# Altium schematic sheet BTN7971b.SchDoc
size A4
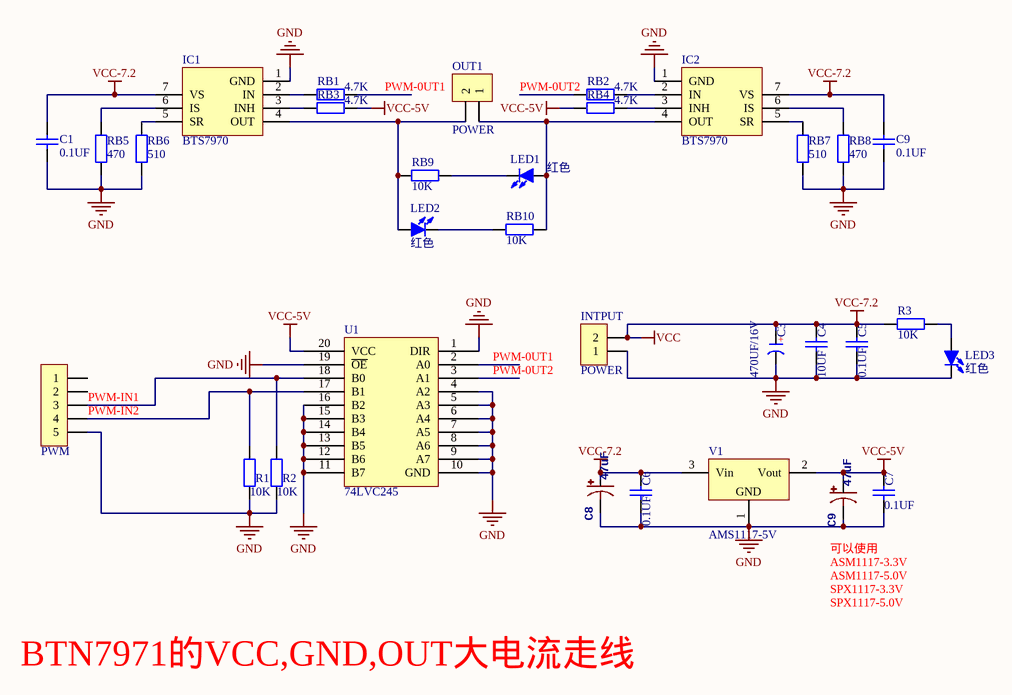
[diagram p0: BTN7971b.SchDoc]

## Parts
(Parts that share a designator on the sheet are numbered #1, #2 ... from top to bottom, then left to right.)
C1  0.1UF  [R/C 0805]
C3  470UF/16V  [CM E(8*10.2)]
C4  10UF  [R/C 0805]
C5  0.1UF  [R/C 0805]
C6  0.1UF  [R/C 0805]
C7  0.1UF  [R/C 0805]
C8  47uF  [EIA3216]
C9#1  0.1UF  [R/C 0805]
C9#2  47uF  [EIA3216]
IC1  BTS7970  [TO263-7A]
IC2  BTS7970  [TO263-7A]
INTPUT  POWER  [XT30]
LED1  红色  [LED 0805R]
LED2  红色  [LED 0805R]
LED3  红色  [LED 0805R]
OUT1  POWER  [XT30]
PWM  HDR-1X5  [XH2.54-LI-5P]  (value not drawn)
R1  10K  [R/C 0805]
R2  10K  [R/C 0805]
R3  10K  [R/C 0805]
RB1  4.7K  [R/C 0805]
RB2  4.7K  [R/C 0805]
RB3  4.7K  [R/C 0805]
RB4  4.7K  [R/C 0805]
RB5  470  [R/C 0805]
RB6  510  [R/C 0805]
RB7  510  [R/C 0805]
RB8  470  [R/C 0805]
RB9  10K  [R/C 0805]
RB10  10K  [R/C 0805]
U1  74LVC245  [SOP-16]
V1  AMS1117-5V  [SOT223_N]

## Nets
GND: C1.1 C3.2(K) C4.1 C5.1 C6.1 C7.1 C8.C(-) C9#1.1 C9#2.C(-) IC1.1(GND) IC2.1(GND) INTPUT.1 LED3.2(K) PWM.5 R1.1 R2.1 RB5.1 RB6.1 RB7.1 RB8.1 U1.1(DIR) U1.4(A2) U1.5(A3) U1.6(A4) U1.7(A5) U1.8(A6) U1.9(A7) U1.10(GND) U1.11(B7) U1.12(B6) U1.13(B5) U1.14(B4) U1.15(B3) U1.16(B2) U1.19(~{OE}) V1.1(GND)
VCC: C1.2 C3.1(A) C4.2 C5.2 C6.2 C8.A(+) C9#1.2 IC1.7(VS) IC2.7(VS) INTPUT.2 R3.2 V1.3(Vin)  [also labelled VCC-7.2]
VCC-5V: C7.2 C9#2.A(+) RB3.1 RB4.2 U1.20(VCC) V1.2(Vout)
PWM-0UT1: RB1.1 U1.2(A0)
PWM-0UT2: RB2.2 U1.3(A1)
PWM-IN1: PWM.3 R2.2 U1.18(B0)
PWM-IN2: PWM.4 R1.2 U1.17(B1)
NetIC1_2: IC1.2(IN) RB1.2
NetIC1_3: IC1.3(INH) RB3.2
NetIC1_4: IC1.4(OUT) LED2.1(A) OUT1.2 RB9.1
NetIC1_5: IC1.5(SR) RB6.2
NetIC1_6: IC1.6(IS) RB5.2
NetIC2_2: IC2.2(IN) RB2.1
NetIC2_3: IC2.3(INH) RB4.1
NetIC2_4: IC2.4(OUT) LED1.1(A) OUT1.1 RB10.2
NetIC2_5: IC2.5(SR) RB7.2
NetIC2_6: IC2.6(IS) RB8.2
NetLED1_2: LED1.2(K) RB9.2
NetLED2_2: LED2.2(K) RB10.1
NetLED3_1: LED3.1(A) R3.1

Not connected (* = marked no-connect by the designer): PWM 1 2

## Notes on the sheet
- 可以使用
  ASM1117-3.3V
  ASM1117-5.0V
  SPX1117-3.3V
  SPX1117-5.0V
- BTN7971的VCC,GND,OUT大电流走线
- (in symbol C-CM) +

## Library data of the parts
C1 C4-C7 C9#1 = CAP
C3 = C-CM: 贴片电解电容; 版权归属: 源创客; BOM名称: 贴片电解电容; 学习资源: www.ooocke.com
C8 C9#2 = CAP_POL1206: Capacitor PolarizedThese are standard SMD and PTH capacitors. Normally 10uF, 47uF, and 100uF in electrolytic and tantalum varieties. Always verify the external diameter of the through hole cap, it varies with capacity, voltage, and manufacturer. The EIA devices should be standard.
IC1 IC2 = BTS7970: 电机驱动芯片; 版权归属: 源创客; BOM名称: 电机驱动芯片; 学习资源: www.ooocke.com
INTPUT OUT1 = Header 2 L
LED1-LED3 = LED-SMD: 贴片LED; 版权归属: 源创客; BOM名称: 贴片LED; 学习资源: www.ooocke.com
PWM = Header 5: 5P接插件; 版权归属: 源创客; BOM名称: 5P接插件; 学习资源: www.ooocke.com
R1-R3 RB1-RB10 = RESISTER
V1 = AMS1117: 三端稳压芯片; BOM名称: 稳压芯片; 版权归属: 源创客; 学习资源: www.ooocke.com